# EasyEDA schematic pcb.json
TITLE: Schematic - Battlebots; REV: 1.0; Date: 2024-10-15; Sheet: 1/1; Drawn By: Kunal Kaushik; Company: Rift Robotics
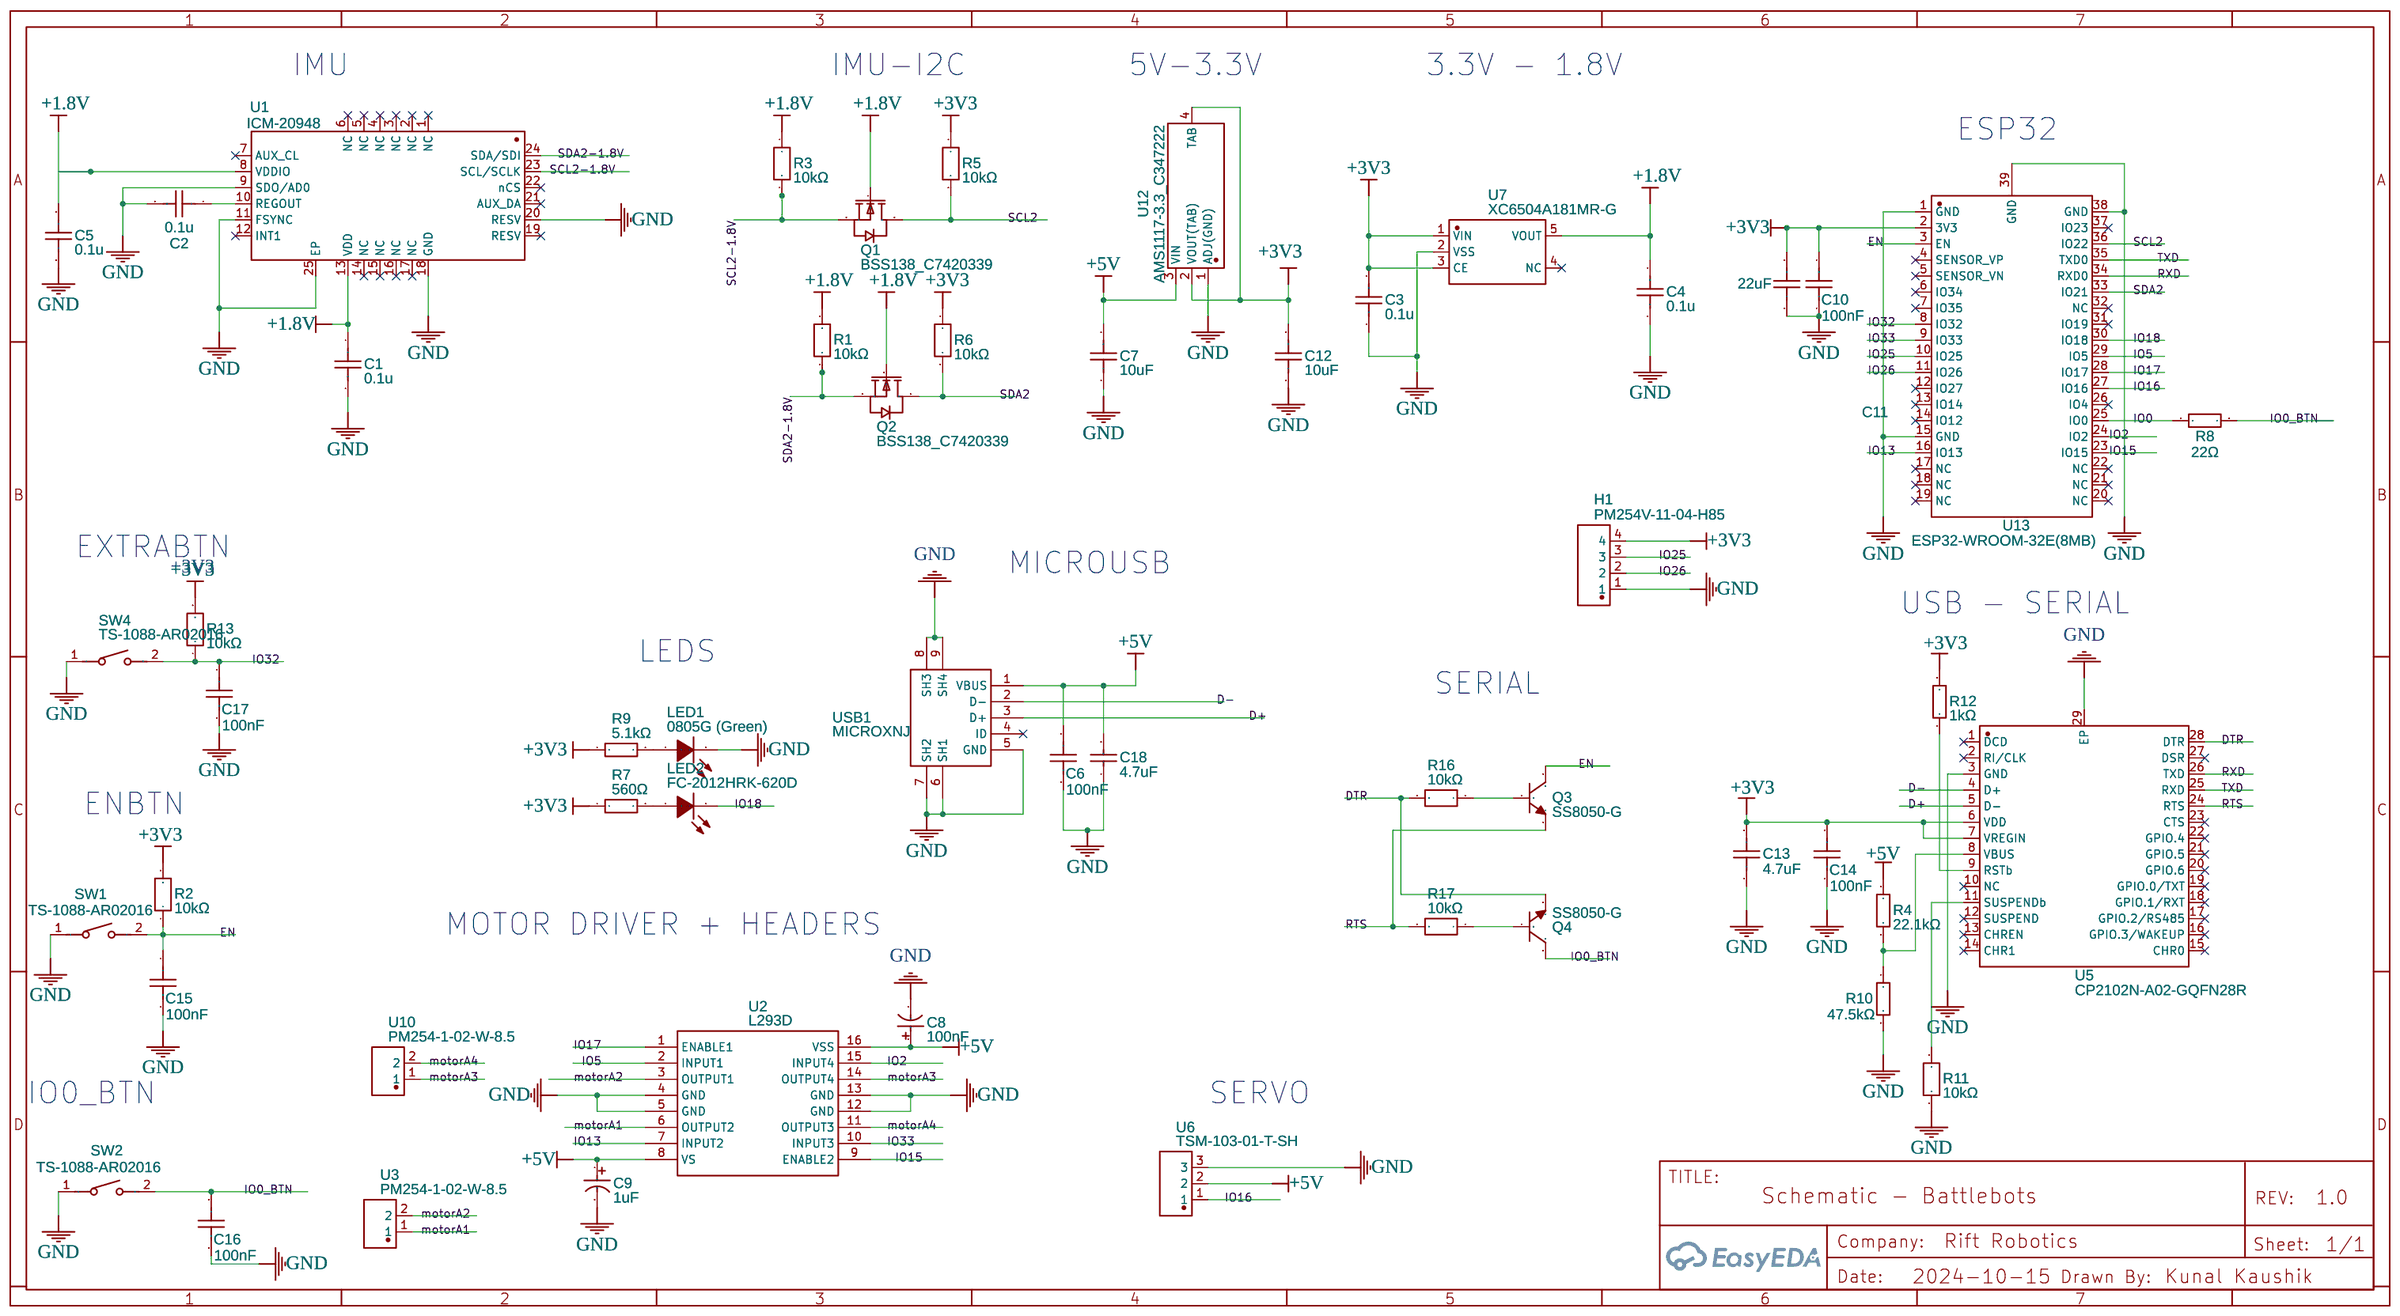
[diagram p0: schematic sheet]

## Parts
C1  0.1u  [C0603]
C2  0.1u  [C0603]
C3  0.1u  [C0603]
C4  0.1u  [C0603]
C5  0.1u  [C0603]
C6  100nF  [C0603]
C7  10uF  [C0402]
C8  100nF  [CAP-TH_BD4.0-P1.50-D0.8-FD]
C9  1uF  [CAP-TH_BD4.0-P1.50-D0.8-FD]
C10  100nF  [C0603]
C11  22uF  [C0805]
C12  10uF  [C0402]
C13  4.7uF  [C0402]
C14  100nF  [C0603]
C15  100nF  [C0603]
C16  100nF  [C0603]
C17  100nF  [C0603]
C18  4.7uF  [C0603]
H1  PM254V-11-04-H85  [HDR-TH_4P-P2.54-V-F]
LED1  0805G (Green)  [LED0805-R-RD]
LED2  FC-2012HRK-620D  [LED0805-R-RD]
Q1  BSS138_C7420339  [SOT-23-3_L2.9-W1.3-P1.90-LS2.4-BR]
Q2  BSS138_C7420339  [SOT-23-3_L2.9-W1.3-P1.90-LS2.4-BR]
Q3  SS8050-G  [SOT-23-3_L2.9-W1.3-P1.90-LS2.4-BR]
Q4  SS8050-G  [SOT-23-3_L2.9-W1.3-P1.90-LS2.4-BR]
R1  10kΩ  [R0603]
R2  10kΩ  [R0603]
R3  10kΩ  [R0603]
R4  22.1kΩ  [R0402]
R5  10kΩ  [R0603]
R6  10kΩ  [R0603]
R7  560Ω  [R0402]
R8  22Ω  [R0402]
R9  5.1kΩ  [R0402]
R10  47.5kΩ  [R0402]
R11  10kΩ  [R0603]
R12  1kΩ  [R0402]
R13  10kΩ  [R0603]
R16  10kΩ  [R0603]
R17  10kΩ  [R0603]
SW1  TS-1088-AR02016  [SW-SMD_L3.9-W3.0-P4.45]
SW2  TS-1088-AR02016  [SW-SMD_L3.9-W3.0-P4.45]
SW4  TS-1088-AR02016  [SW-SMD_L3.9-W3.0-P4.45]
U1  ICM-20948  [QFN-24_L3.0-W3.0-P0.40-BL-EP]
U2  L293D  [DIP-16_L20.0-W6.4-P2.54-LS7.6-BL]
U3  PM254-1-02-W-8.5  [HDR-TH_2P-P2.54-H-F-W10.0-N]
U5  CP2102N-A02-GQFN28R  [QFN-28_L5.0-W5.0-P0.50-TL-EP3.3]
U6  TSM-103-01-T-SH  [HDR-SMD_3P-P2.54-H-M]
U7  XC6504A181MR-G  [SOT-25_L3.0-W1.6-P0.95-LS2.8-BR]
U10  PM254-1-02-W-8.5  [HDR-TH_2P-P2.54-H-F-W10.0-N]
U12  AMS1117-3.3_C347222  [SOT-223-4_L6.5-W3.5-P2.30-LS7.0-BR]
U13  ESP32-WROOM-32E(8MB)  [WIFI-SMD_ESP32-WROOM-32E]
USB1  MICROXNJ  [MICRO-USB-SMD_MICROXNJ]

## Library data of the parts
C1-C5 = C_0603_US: Contributor: LCEDA_Lib
C6 C10 C14-C17 = GCM188R11H104KA42D: Contributor: LCSC; Supplier: LCSC; Supplier Part: C913754; Manufacturer: muRata(村田); JLCPCB Part Class: Extended Part
C7 C12 = CL05A106MP5NUNC_C315248: Contributor: LCSC; Supplier: LCSC; Supplier Part: C315248; Manufacturer: SAMSUNG(三星); Manufacturer Part: CL05A106MP5NUNC; JLCPCB Part Class: Extended Part
C8 = 0.1uF 50V 4*7: Supplier: LCSC; Manufacturer: CX(承兴); Manufacturer Part: KS104M050C07RR0VH2FP0; Supplier Part: C45664; JLCPCB Part Class: Extended Part
C9 = 1uF 50V 4*5: Supplier: LCSC; Manufacturer: CX(承兴); Manufacturer Part: KF105M050C05RR0VH2FP0; Supplier Part: C47848; JLCPCB Part Class: Extended Part
C11 = CL21A226MAYNNNE: Contributor: LCSC; Supplier: LCSC; Supplier Part: C602037; Manufacturer: SAMSUNG(三星); JLCPCB Part Class: Extended Part
C13 = CL05A475KP5NRNC: Contributor: LCSC; Supplier: LCSC; Supplier Part: C368809; Manufacturer: SAMSUNG(三星); JLCPCB Part Class: Extended Part
C18 = CL10A475KP8NNNC: Supplier: LCSC; Manufacturer: SAMSUNG(三星); Supplier Part: C1705; JLCPCB Part Class: Extended Part
H1 = PM254V-11-04-H85: Contributor: LCSC; Supplier: LCSC; Supplier Part: C541851; Manufacturer: XFCN(兴飞); JLCPCB Part Class: Extended Part
LED1 = 0805G (Green): Supplier: LCSC; Manufacturer: KENTO; Manufacturer Part: KT-0805G; Supplier Part: C2297; JLCPCB Part Class: Basic Part
LED2 = FC-2012HRK-620D: Supplier: LCSC; Manufacturer: 国星光电; Manufacturer Part: NCD0805R1; Supplier Part: C84256; JLCPCB Part Class: Basic Part
Q1 Q2 = BSS138_C7420339: Contributor: lcsc; Supplier: LCSC; Supplier Part: C7420339; Manufacturer: 宏迦橙; Manufacturer Part: BSS138; JLCPCB Part Class: Extended Part
Q3 Q4 = SS8050-G: Contributor: LCSC; Supplier: LCSC; Manufacturer: CJ(江苏长电/长晶); Manufacturer Part: SS8050-G(RANGE:120-200); Supplier Part: C164886; JLCPCB Part Class: Extended Part
R1-R3 R5 R6 R11 R13 R16 R17 = SCR0603J10K: Supplier: LCSC; Supplier Part: C3017715; Manufacturer: VO(翔胜); Contributor: lcsc; JLCPCB Part Class: Extended Part
R4 = 0402WGF2212TCE: Supplier: LCSC; Manufacturer: UNI-ROYAL(厚声); Supplier Part: C43473; JLCPCB Part Class: Extended Part
R7 = 0402WGJ0561TCE: Supplier: LCSC; Manufacturer: UNI-ROYAL(厚声); Supplier Part: C25172; JLCPCB Part Class: Extended Part
R8 = 0402WGF220JTCE: Supplier: LCSC; Manufacturer: UNI-ROYAL(厚声); Supplier Part: C25092; JLCPCB Part Class: Basic Part
R9 = 0402WGF5101TCE: Supplier: LCSC; Manufacturer: UNI-ROYAL(厚声); Supplier Part: C25905; JLCPCB Part Class: Basic Part
R10 = 0402WGF4752TCE: Supplier: LCSC; Manufacturer: UNI-ROYAL(厚声); Supplier Part: C25896; JLCPCB Part Class: Extended Part
R12 = 0402WGF1001TCE: Supplier: LCSC; Manufacturer: UNI-ROYAL(厚声); Supplier Part: C11702; JLCPCB Part Class: Basic Part
SW1 SW2 SW4 = TS-1088-AR02016: Contributor: LCSC; Supplier: LCSC; Supplier Part: C720477; Manufacturer: XUNPU(讯普); JLCPCB Part Class: Extended Part
U1 = ICM-20948: Contributor: lcsc; Supplier: LCSC; Supplier Part: C726001; Manufacturer: TDK InvenSense(应美盛); JLCPCB Part Class: Extended Part
U2 = L293D: Contributor: pitreluc; Supplier: LCSC; Manufacturer: ST(意法半导体); Supplier Part: C12340; JLCPCB Part Class: Extended Part
U3 U10 = PM254-1-02-W-8.5: Contributor: LCSC; Supplier: LCSC; Supplier Part: C2897384; Manufacturer: HCTL(华灿天禄); JLCPCB Part Class: Extended Part
U5 = CP2102N-A02-GQFN28R: Contributor: LCSC; Supplier: LCSC; Supplier Part: C964632; Manufacturer: SKYWORKS/SILICON LABS(芯科); JLCPCB Part Class: Extended Part
U6 = TSM-103-01-T-SH: Supplier: LCSC; Supplier Part: C6339013; Manufacturer: SAMTEC; JLCPCB Part Class: Extended Part; Contributor: lcsc
U7 = XC6504A181MR-G: Contributor: lcsc; Supplier: LCSC; Supplier Part: C3013659; Manufacturer: TOREX(特瑞仕); JLCPCB Part Class: Extended Part
U12 = AMS1117-3.3_C347222: Contributor: LCSC; Supplier: LCSC; Supplier Part: C347222; Manufacturer: UMW(友台半导体); Manufacturer Part: AMS1117-3.3; JLCPCB Part Class: Extended Part
U13 = ESP32-WROOM-32E(8MB): Contributor: LCSC; Supplier: LCSC; Supplier Part: C701342; Manufacturer: ESPRESSIF(乐鑫); Manufacturer Part: ESP32-WROOM-32E-N8; JLCPCB Part Class: Extended Part
USB1 = MICROXNJ: Contributor: LCSC; Supplier: LCSC; Supplier Part: C404969; Manufacturer: SHOU HAN(首韩); Manufacturer Part: MicroXNJ; JLCPCB Part Class: Extended Part

## Nets
+1.8V: C1.1 C4.1 C5.1 Q1.1(G) Q2.1(G) R1.2 R3.1 U1.8(VDDIO) U1.13(VDD) U7.5(VOUT)
+3V3: C3.1 C10.1 C11.2 C12.2 C13.2 C14.1 H1.4 R2.2 R5.1 R6.1 R7.1 R9.1 R12.2 R13.2 U5.6(VDD) U5.7(VREGIN) U7.1(VIN) U7.3(CE) U12.2(VOUT(TAB)) U12.4(TAB) U13.2(3V3)
+5V: C6.1 C7.2 C8.1 C9.1 C18.2 R4.2 U2.8(VS) U2.16(VSS) U6.2 U12.3(VIN) USB1.1(VBUS)
GND: C1.2 C2.2 C3.2 C4.2 C5.2 C6.2 C7.1 C8.2 C9.2 C10.2 C11.1 C12.1 C13.1 C14.2 C15.2 C16.2 C17.2 C18.1 H1.1 LED1.2(K) R10.2 R11.1 SW1.1 SW2.1 SW4.1 U1.9(SDO/AD0) U1.11(FSYNC) U1.18(GND) U1.20(RESV) U1.25(EP) U2.4(GND) U2.5(GND) U2.12(GND) U2.13(GND) U5.3(GND) U5.29(EP) U6.3 U7.2(VSS) U12.1(ADJ(GND)) U13.1(GND) U13.15(GND) U13.38(GND) U13.39(GND) USB1.5(GND) USB1.6(SH1) USB1.7(SH2) USB1.8(SH3) USB1.9(SH4)
D+: U5.5(D-) USB1.3(D+)
D-: U5.4(D+) USB1.2(D-)
DTR: Q4.2(E) R16.2 U5.28(DTR)
EN: C15.1 Q3.3(C) R2.1 SW1.2 U13.3(EN)
IO0: R8.1 U13.25(IO0)
IO0_BTN: C16.1 Q4.3(C) R8.2 SW2.2
IO2: U2.15(INPUT4) U13.24(IO2)
IO5: U2.2(INPUT1) U13.29(IO5)
IO13: U2.7(INPUT2) U13.16(IO13)
IO15: U2.9(ENABLE2) U13.23(IO15)
IO16: U6.1 U13.27(IO16)
IO17: U2.1(ENABLE1) U13.28(IO17)
IO18: LED2.2(-) U13.30(IO18)
IO25: H1.3 U13.10(IO25)
IO26: H1.2 U13.11(IO26)
IO32: C17.1 R13.1 SW4.2 U13.8(IO32)
IO33: U2.10(INPUT3) U13.9(IO33)
motorA1: U2.6(OUTPUT2) U3.1
motorA2: U2.3(OUTPUT1) U3.2
motorA3: U2.14(OUTPUT4) U10.1
motorA4: U2.11(OUTPUT3) U10.2
RTS: Q3.2(E) R17.2 U5.24(RTS)
RXD: U5.26(TXD) U13.34(RXD0)
SCL2: Q1.3(D) R5.2 U13.36(IO22)
SCL2-1.8V: Q1.2(S) R3.2 U1.23(SCL/SCLK)
SDA2: Q2.3(D) R6.2 U13.33(IO21)
SDA2-1.8V: Q2.2(S) R1.1 U1.24(SDA/SDI)
TXD: U5.25(RXD) U13.35(TXD0)
Net-(C2-1): C2.1 U1.10(REGOUT)
Net-(LED1-1): LED1.1(A) R9.2
Net-(LED2-1): LED2.1(+) R7.2
Net-(Q3-1): Q3.1(B) R16.1
Net-(Q4-1): Q4.1(B) R17.1
Net-(R4-1): R4.1 R10.1 U5.8(VBUS)
Net-(R11-2): R11.2 U5.11(SUSPENDb)
Net-(R12-1): R12.1 U5.9(RSTb)

Not connected (* = marked no-connect by the designer): U1 1(NC)* 2(NC)* 3(NC)* 4(NC)* 5(NC)* 6(NC)* 7(AUX_CL)* 12(INT1)* 14(NC)* 15(NC)* 16(NC)* 17(NC)* 19(RESV)* 21(AUX_DA)* 22(nCS)*; U5 1(DCD)* 2(RI/CLK)* 10(NC)* 12(SUSPEND)* 13(CHREN)* 14(CHR1)* 15(CHR0)* 16(GPIO.3/WAKEUP)* 17(GPIO.2/RS485)* 18(GPIO.1/RXT)* 19(GPIO.0/TXT)* 20(GPIO.6)* 21(GPIO.5)* 22(GPIO.4)* 23(CTS)* 27(DSR)*; U7 4(NC)*; U13 4(SENSOR_VP)* 5(SENSOR_VN)* 6(IO34)* 7(IO35)* 12(IO27)* 13(IO14)* 14(IO12)* 17(NC)* 18(NC)* 19(NC)* 20(NC)* 21(NC)* 22(NC)* 26(IO4)* 31(IO19)* 32(NC)* 37(IO23)*; USB1 4(ID)*

## Notes on the sheet
- IMU
- IMU-I2C
- 5V-3.3V
- 3.3V - 1.8V
- ESP32
- EXTRABTN
- +3V3
- MICROUSB
- USB - SERIAL
- LEDS
- SERIAL
- ENBTN
- MOTOR DRIVER + HEADERS
- IO0_BTN
- SERVO
